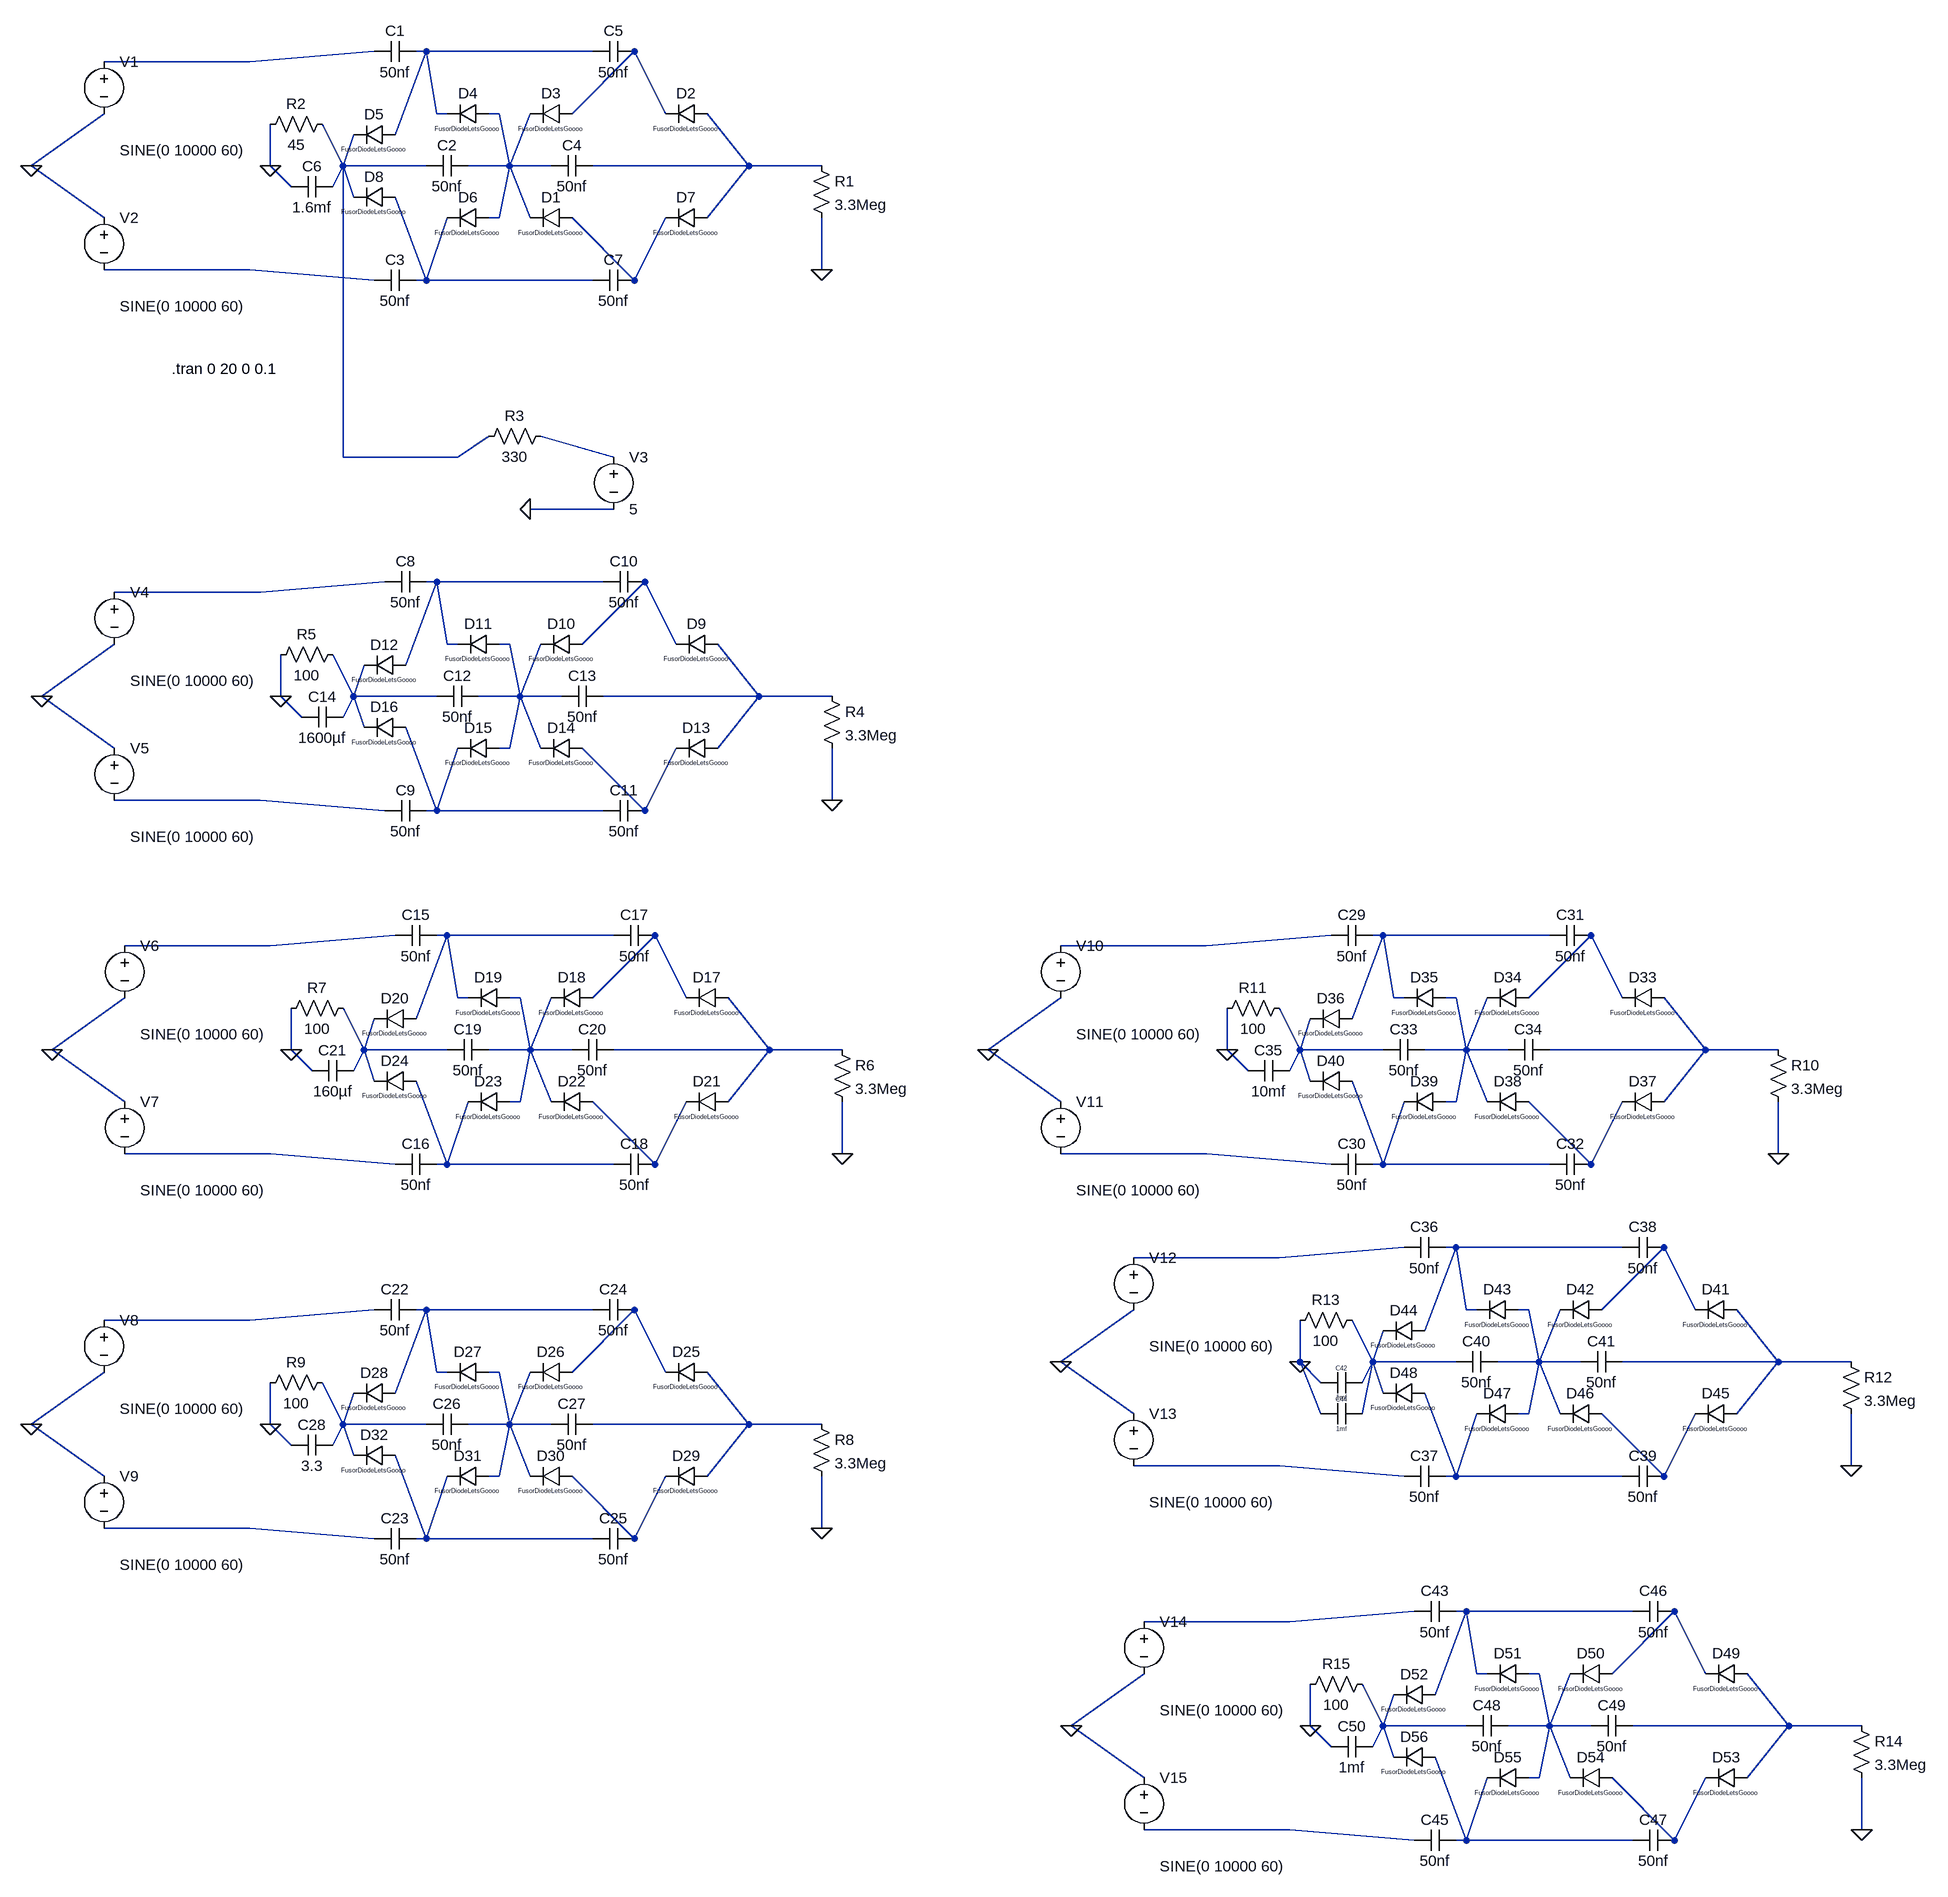
[diagram p0: schematic CW Schematic backup.asc]
CW Schematic backup.asc, the LTspice schematic file:
Version 4
SHEET 1 2396 2776
WIRE 80 -32 64 -32
WIRE 336 -32 80 -32
WIRE -192 -16 0 -32
WIRE -192 -16 -416 -16
WIRE 96 64 80 -32
WIRE 112 64 96 64
WIRE 192 64 176 64
WIRE 304 64 400 -32
WIRE 448 64 400 -32
WIRE 32 96 80 -32
WIRE -528 144 -416 64
WIRE -160 144 -160 80
WIRE -48 144 -80 80
WIRE -48 144 -32 96
WIRE 80 144 -48 144
WIRE 208 144 192 64
WIRE 208 144 240 64
WIRE 208 144 144 144
WIRE 272 144 208 144
WIRE 576 144 512 64
WIRE 576 144 336 144
WIRE 688 144 576 144
WIRE -128 176 -160 144
WIRE -64 176 -48 144
WIRE -32 192 -48 144
WIRE -416 224 -528 144
WIRE 192 224 208 144
WIRE 192 224 176 224
WIRE 240 224 208 144
WIRE 512 224 576 144
WIRE -192 304 -416 304
WIRE 688 304 688 224
WIRE 0 320 -192 304
WIRE 80 320 32 192
WIRE 80 320 112 224
WIRE 80 320 64 320
WIRE 336 320 80 320
WIRE 400 320 304 224
WIRE 400 320 448 224
WIRE -48 592 -48 144
WIRE 128 592 176 560
WIRE 128 592 -48 592
WIRE 368 592 256 560
WIRE 368 672 240 672
WIRE 96 784 80 784
WIRE 352 784 96 784
WIRE -176 800 16 784
WIRE -176 800 -400 800
WIRE 112 880 96 784
WIRE 128 880 112 880
WIRE 208 880 192 880
WIRE 320 880 416 784
WIRE 464 880 416 784
WIRE 48 912 96 784
WIRE -512 960 -400 880
WIRE -144 960 -144 896
WIRE -32 960 -64 896
WIRE -32 960 -16 912
WIRE 96 960 -32 960
WIRE 224 960 208 880
WIRE 224 960 256 880
WIRE 224 960 160 960
WIRE 288 960 224 960
WIRE 592 960 528 880
WIRE 592 960 352 960
WIRE 704 960 592 960
WIRE -112 992 -144 960
WIRE -48 992 -32 960
WIRE -16 1008 -32 960
WIRE -400 1040 -512 960
WIRE 208 1040 224 960
WIRE 208 1040 192 1040
WIRE 256 1040 224 960
WIRE 528 1040 592 960
WIRE -176 1120 -400 1120
WIRE 704 1120 704 1040
WIRE 16 1136 -176 1120
WIRE 96 1136 48 1008
WIRE 96 1136 128 1040
WIRE 96 1136 80 1136
WIRE 352 1136 96 1136
WIRE 416 1136 320 1040
WIRE 416 1136 464 1040
WIRE 112 1328 96 1328
WIRE 368 1328 112 1328
WIRE 1552 1328 1536 1328
WIRE 1808 1328 1552 1328
WIRE -160 1344 32 1328
WIRE -160 1344 -384 1344
WIRE 1280 1344 1472 1328
WIRE 1280 1344 1056 1344
WIRE 128 1424 112 1328
WIRE 144 1424 128 1424
WIRE 224 1424 208 1424
WIRE 336 1424 432 1328
WIRE 480 1424 432 1328
WIRE 1568 1424 1552 1328
WIRE 1584 1424 1568 1424
WIRE 1664 1424 1648 1424
WIRE 1776 1424 1872 1328
WIRE 1920 1424 1872 1328
WIRE 64 1456 112 1328
WIRE 1504 1456 1552 1328
WIRE -496 1504 -384 1424
WIRE -128 1504 -128 1440
WIRE -16 1504 -48 1440
WIRE -16 1504 0 1456
WIRE 112 1504 -16 1504
WIRE 240 1504 224 1424
WIRE 240 1504 272 1424
WIRE 240 1504 176 1504
WIRE 304 1504 240 1504
WIRE 608 1504 544 1424
WIRE 608 1504 368 1504
WIRE 720 1504 608 1504
WIRE 944 1504 1056 1424
WIRE 1312 1504 1312 1440
WIRE 1424 1504 1392 1440
WIRE 1424 1504 1440 1456
WIRE 1552 1504 1424 1504
WIRE 1680 1504 1664 1424
WIRE 1680 1504 1712 1424
WIRE 1680 1504 1616 1504
WIRE 1744 1504 1680 1504
WIRE 2048 1504 1984 1424
WIRE 2048 1504 1808 1504
WIRE 2160 1504 2048 1504
WIRE -96 1536 -128 1504
WIRE -32 1536 -16 1504
WIRE 1344 1536 1312 1504
WIRE 1408 1536 1424 1504
WIRE 0 1552 -16 1504
WIRE 1440 1552 1424 1504
WIRE -384 1584 -496 1504
WIRE 224 1584 240 1504
WIRE 224 1584 208 1584
WIRE 272 1584 240 1504
WIRE 544 1584 608 1504
WIRE 1056 1584 944 1504
WIRE 1664 1584 1680 1504
WIRE 1664 1584 1648 1584
WIRE 1712 1584 1680 1504
WIRE 1984 1584 2048 1504
WIRE -160 1664 -384 1664
WIRE 720 1664 720 1584
WIRE 1280 1664 1056 1664
WIRE 2160 1664 2160 1584
WIRE 32 1680 -160 1664
WIRE 112 1680 64 1552
WIRE 112 1680 144 1584
WIRE 112 1680 96 1680
WIRE 368 1680 112 1680
WIRE 432 1680 336 1584
WIRE 432 1680 480 1584
WIRE 1472 1680 1280 1664
WIRE 1552 1680 1504 1552
WIRE 1552 1680 1584 1584
WIRE 1552 1680 1536 1680
WIRE 1808 1680 1552 1680
WIRE 1872 1680 1776 1584
WIRE 1872 1680 1920 1584
WIRE 1664 1808 1648 1808
WIRE 1920 1808 1664 1808
WIRE 1392 1824 1584 1808
WIRE 1392 1824 1168 1824
WIRE 80 1904 64 1904
WIRE 336 1904 80 1904
WIRE 1680 1904 1664 1808
WIRE 1696 1904 1680 1904
WIRE 1776 1904 1760 1904
WIRE 1888 1904 1984 1808
WIRE 2032 1904 1984 1808
WIRE -192 1920 0 1904
WIRE -192 1920 -416 1920
WIRE 1616 1936 1664 1808
WIRE 1056 1984 1168 1904
WIRE 1424 1984 1424 1920
WIRE 1536 1984 1504 1920
WIRE 1536 1984 1552 1936
WIRE 1664 1984 1536 1984
WIRE 1792 1984 1776 1904
WIRE 1792 1984 1824 1904
WIRE 1792 1984 1728 1984
WIRE 1856 1984 1792 1984
WIRE 2160 1984 2096 1904
WIRE 2160 1984 1920 1984
WIRE 2272 1984 2160 1984
WIRE 96 2000 80 1904
WIRE 112 2000 96 2000
WIRE 192 2000 176 2000
WIRE 304 2000 400 1904
WIRE 448 2000 400 1904
WIRE 1456 2016 1424 1984
WIRE 1520 2016 1536 1984
WIRE 32 2032 80 1904
WIRE 1552 2032 1536 1984
WIRE 1168 2064 1056 1984
WIRE 1456 2064 1424 1984
WIRE 1520 2064 1536 1984
WIRE 1776 2064 1792 1984
WIRE 1776 2064 1760 2064
WIRE 1824 2064 1792 1984
WIRE 2096 2064 2160 1984
WIRE -528 2080 -416 2000
WIRE -160 2080 -160 2016
WIRE -48 2080 -80 2016
WIRE -48 2080 -32 2032
WIRE 80 2080 -48 2080
WIRE 208 2080 192 2000
WIRE 208 2080 240 2000
WIRE 208 2080 144 2080
WIRE 272 2080 208 2080
WIRE 576 2080 512 2000
WIRE 576 2080 336 2080
WIRE 688 2080 576 2080
WIRE -128 2112 -160 2080
WIRE -64 2112 -48 2080
WIRE -32 2128 -48 2080
WIRE 1392 2144 1168 2144
WIRE 2272 2144 2272 2064
WIRE -416 2160 -528 2080
WIRE 192 2160 208 2080
WIRE 192 2160 176 2160
WIRE 240 2160 208 2080
WIRE 512 2160 576 2080
WIRE 1584 2160 1392 2144
WIRE 1664 2160 1616 2032
WIRE 1664 2160 1696 2064
WIRE 1664 2160 1648 2160
WIRE 1920 2160 1664 2160
WIRE 1984 2160 1888 2064
WIRE 1984 2160 2032 2064
WIRE -192 2240 -416 2240
WIRE 688 2240 688 2160
WIRE 0 2256 -192 2240
WIRE 80 2256 32 2128
WIRE 80 2256 112 2160
WIRE 80 2256 64 2256
WIRE 336 2256 80 2256
WIRE 400 2256 304 2160
WIRE 400 2256 448 2160
WIRE 1680 2368 1664 2368
WIRE 1936 2368 1680 2368
WIRE 1408 2384 1600 2368
WIRE 1408 2384 1184 2384
WIRE 1696 2464 1680 2368
WIRE 1712 2464 1696 2464
WIRE 1792 2464 1776 2464
WIRE 1904 2464 2000 2368
WIRE 2048 2464 2000 2368
WIRE 1632 2496 1680 2368
WIRE 1072 2544 1184 2464
WIRE 1440 2544 1440 2480
WIRE 1552 2544 1520 2480
WIRE 1552 2544 1568 2496
WIRE 1680 2544 1552 2544
WIRE 1808 2544 1792 2464
WIRE 1808 2544 1840 2464
WIRE 1808 2544 1744 2544
WIRE 1872 2544 1808 2544
WIRE 2176 2544 2112 2464
WIRE 2176 2544 1936 2544
WIRE 2288 2544 2176 2544
WIRE 1472 2576 1440 2544
WIRE 1536 2576 1552 2544
WIRE 1568 2592 1552 2544
WIRE 1184 2624 1072 2544
WIRE 1792 2624 1808 2544
WIRE 1792 2624 1776 2624
WIRE 1840 2624 1808 2544
WIRE 2112 2624 2176 2544
WIRE 1408 2704 1184 2704
WIRE 2288 2704 2288 2624
WIRE 1600 2720 1408 2704
WIRE 1680 2720 1632 2592
WIRE 1680 2720 1712 2624
WIRE 1680 2720 1664 2720
WIRE 1936 2720 1680 2720
WIRE 2000 2720 1904 2624
WIRE 2000 2720 2048 2624
FLAG -160 144 0
FLAG 688 304 0
FLAG -528 144 0
FLAG 240 672 0
FLAG -144 960 0
FLAG 704 1120 0
FLAG -512 960 0
FLAG -128 1504 0
FLAG 720 1664 0
FLAG -496 1504 0
FLAG -160 2080 0
FLAG 688 2240 0
FLAG -528 2080 0
FLAG 1312 1504 0
FLAG 2160 1664 0
FLAG 944 1504 0
FLAG 1424 1984 0
FLAG 2272 2144 0
FLAG 1056 1984 0
FLAG 1440 2544 0
FLAG 2288 2704 0
FLAG 1072 2544 0
SYMBOL cap 0 -16 R270
WINDOW 0 32 32 VTop 2
WINDOW 3 0 32 VBottom 2
SYMATTR InstName C1
SYMATTR Value 50nf
SYMATTR SpiceLine V=30kV
SYMBOL cap 0 336 R270
WINDOW 0 32 32 VTop 2
WINDOW 3 0 32 VBottom 2
SYMATTR InstName C3
SYMATTR Value 50nf
SYMATTR SpiceLine V=30kV
SYMBOL cap 336 -16 R270
WINDOW 0 32 32 VTop 2
WINDOW 3 0 32 VBottom 2
SYMATTR InstName C5
SYMATTR Value 50nf
SYMATTR SpiceLine V=30kV
SYMBOL voltage -416 -32 R0
WINDOW 123 24 124 Left 2
WINDOW 39 0 0 Left 0
WINDOW 3 24 152 Left 2
SYMATTR Value SINE(0 10000 60)
SYMATTR InstName V1
SYMBOL cap 336 336 R270
WINDOW 0 32 32 VTop 2
WINDOW 3 0 32 VBottom 2
SYMATTR InstName C7
SYMATTR Value 50nf
SYMATTR SpiceLine V=30kV
SYMBOL res 672 128 R0
SYMATTR InstName R1
SYMATTR Value 3.3Meg
SYMBOL cap 80 160 R270
WINDOW 0 32 32 VTop 2
WINDOW 3 0 32 VBottom 2
SYMATTR InstName C2
SYMATTR Value 50nf
SYMATTR SpiceLine V=30kV
SYMBOL cap 272 160 R270
WINDOW 0 32 32 VTop 2
WINDOW 3 0 32 VBottom 2
SYMATTR InstName C4
SYMATTR Value 50nf
SYMATTR SpiceLine V=30kV
SYMBOL diode 512 48 R90
WINDOW 0 0 32 VBottom 2
WINDOW 3 32 32 VTop 0
SYMATTR InstName D2
SYMATTR Value FusorDiodeLetsGoooo
SYMBOL diode 304 48 R90
WINDOW 0 0 32 VBottom 2
WINDOW 3 32 32 VTop 0
SYMATTR InstName D3
SYMATTR Value FusorDiodeLetsGoooo
SYMBOL diode 176 48 R90
WINDOW 0 0 32 VBottom 2
WINDOW 3 32 32 VTop 0
SYMATTR InstName D4
SYMATTR Value FusorDiodeLetsGoooo
SYMBOL diode 32 80 R90
WINDOW 0 0 32 VBottom 2
WINDOW 3 32 32 VTop 0
SYMATTR InstName D5
SYMATTR Value FusorDiodeLetsGoooo
SYMBOL diode 512 208 R90
WINDOW 0 0 32 VBottom 2
WINDOW 3 32 32 VTop 0
SYMATTR InstName D7
SYMATTR Value FusorDiodeLetsGoooo
SYMBOL diode 304 208 R90
WINDOW 0 0 32 VBottom 2
WINDOW 3 32 32 VTop 0
SYMATTR InstName D1
SYMATTR Value FusorDiodeLetsGoooo
SYMBOL diode 176 208 R90
WINDOW 0 0 32 VBottom 2
WINDOW 3 32 32 VTop 0
SYMATTR InstName D6
SYMATTR Value FusorDiodeLetsGoooo
SYMBOL diode 32 176 R90
WINDOW 0 0 32 VBottom 2
WINDOW 3 32 32 VTop 0
SYMATTR InstName D8
SYMATTR Value FusorDiodeLetsGoooo
SYMBOL res -176 96 R270
WINDOW 0 32 56 VTop 2
WINDOW 3 0 56 VBottom 2
SYMATTR InstName R2
SYMATTR Value 45
SYMBOL voltage -416 208 R0
WINDOW 123 24 124 Left 2
WINDOW 39 0 0 Left 0
WINDOW 3 24 152 Left 2
SYMATTR Value SINE(0 10000 60)
SYMATTR InstName V2
SYMBOL cap -128 192 R270
WINDOW 0 32 32 VTop 2
WINDOW 3 0 32 VBottom 2
SYMATTR InstName C6
SYMATTR Value 1.6mf
SYMBOL voltage 368 576 R0
WINDOW 123 0 0 Left 0
WINDOW 39 0 0 Left 0
SYMATTR InstName V3
SYMATTR Value 5
SYMBOL res 272 544 R90
WINDOW 0 0 56 VBottom 2
WINDOW 3 32 56 VTop 2
SYMATTR InstName R3
SYMATTR Value 330
SYMBOL cap 16 800 R270
WINDOW 0 32 32 VTop 2
WINDOW 3 0 32 VBottom 2
SYMATTR InstName C8
SYMATTR Value 50nf
SYMATTR SpiceLine V=30kV
SYMBOL cap 16 1152 R270
WINDOW 0 32 32 VTop 2
WINDOW 3 0 32 VBottom 2
SYMATTR InstName C9
SYMATTR Value 50nf
SYMATTR SpiceLine V=30kV
SYMBOL cap 352 800 R270
WINDOW 0 32 32 VTop 2
WINDOW 3 0 32 VBottom 2
SYMATTR InstName C10
SYMATTR Value 50nf
SYMATTR SpiceLine V=30kV
SYMBOL voltage -400 784 R0
WINDOW 123 24 124 Left 2
WINDOW 39 0 0 Left 0
WINDOW 3 24 152 Left 2
SYMATTR Value SINE(0 10000 60)
SYMATTR InstName V4
SYMBOL cap 352 1152 R270
WINDOW 0 32 32 VTop 2
WINDOW 3 0 32 VBottom 2
SYMATTR InstName C11
SYMATTR Value 50nf
SYMATTR SpiceLine V=30kV
SYMBOL res 688 944 R0
SYMATTR InstName R4
SYMATTR Value 3.3Meg
SYMBOL cap 96 976 R270
WINDOW 0 32 32 VTop 2
WINDOW 3 0 32 VBottom 2
SYMATTR InstName C12
SYMATTR Value 50nf
SYMATTR SpiceLine V=30kV
SYMBOL cap 288 976 R270
WINDOW 0 32 32 VTop 2
WINDOW 3 0 32 VBottom 2
SYMATTR InstName C13
SYMATTR Value 50nf
SYMATTR SpiceLine V=30kV
SYMBOL diode 528 864 R90
WINDOW 0 0 32 VBottom 2
WINDOW 3 32 32 VTop 0
SYMATTR InstName D9
SYMATTR Value FusorDiodeLetsGoooo
SYMBOL diode 320 864 R90
WINDOW 0 0 32 VBottom 2
WINDOW 3 32 32 VTop 0
SYMATTR InstName D10
SYMATTR Value FusorDiodeLetsGoooo
SYMBOL diode 192 864 R90
WINDOW 0 0 32 VBottom 2
WINDOW 3 32 32 VTop 0
SYMATTR InstName D11
SYMATTR Value FusorDiodeLetsGoooo
SYMBOL diode 48 896 R90
WINDOW 0 0 32 VBottom 2
WINDOW 3 32 32 VTop 0
SYMATTR InstName D12
SYMATTR Value FusorDiodeLetsGoooo
SYMBOL diode 528 1024 R90
WINDOW 0 0 32 VBottom 2
WINDOW 3 32 32 VTop 0
SYMATTR InstName D13
SYMATTR Value FusorDiodeLetsGoooo
SYMBOL diode 320 1024 R90
WINDOW 0 0 32 VBottom 2
WINDOW 3 32 32 VTop 0
SYMATTR InstName D14
SYMATTR Value FusorDiodeLetsGoooo
SYMBOL diode 192 1024 R90
WINDOW 0 0 32 VBottom 2
WINDOW 3 32 32 VTop 0
SYMATTR InstName D15
SYMATTR Value FusorDiodeLetsGoooo
SYMBOL diode 48 992 R90
WINDOW 0 0 32 VBottom 2
WINDOW 3 32 32 VTop 0
SYMATTR InstName D16
SYMATTR Value FusorDiodeLetsGoooo
SYMBOL res -160 912 R270
WINDOW 0 32 56 VTop 2
WINDOW 3 0 56 VBottom 2
SYMATTR InstName R5
SYMATTR Value 100
SYMBOL voltage -400 1024 R0
WINDOW 123 24 124 Left 2
WINDOW 39 0 0 Left 0
WINDOW 3 24 152 Left 2
SYMATTR Value SINE(0 10000 60)
SYMATTR InstName V5
SYMBOL cap -112 1008 R270
WINDOW 0 32 32 VTop 2
WINDOW 3 0 32 VBottom 2
SYMATTR InstName C14
SYMATTR Value 1600µf
SYMBOL cap 32 1344 R270
WINDOW 0 32 32 VTop 2
WINDOW 3 0 32 VBottom 2
SYMATTR InstName C15
SYMATTR Value 50nf
SYMATTR SpiceLine V=30kV
SYMBOL cap 32 1696 R270
WINDOW 0 32 32 VTop 2
WINDOW 3 0 32 VBottom 2
SYMATTR InstName C16
SYMATTR Value 50nf
SYMATTR SpiceLine V=30kV
SYMBOL cap 368 1344 R270
WINDOW 0 32 32 VTop 2
WINDOW 3 0 32 VBottom 2
SYMATTR InstName C17
SYMATTR Value 50nf
SYMATTR SpiceLine V=30kV
SYMBOL voltage -384 1328 R0
WINDOW 123 24 124 Left 2
WINDOW 39 0 0 Left 0
WINDOW 3 24 152 Left 2
SYMATTR Value SINE(0 10000 60)
SYMATTR InstName V6
SYMBOL cap 368 1696 R270
WINDOW 0 32 32 VTop 2
WINDOW 3 0 32 VBottom 2
SYMATTR InstName C18
SYMATTR Value 50nf
SYMATTR SpiceLine V=30kV
SYMBOL res 704 1488 R0
SYMATTR InstName R6
SYMATTR Value 3.3Meg
SYMBOL cap 112 1520 R270
WINDOW 0 32 32 VTop 2
WINDOW 3 0 32 VBottom 2
SYMATTR InstName C19
SYMATTR Value 50nf
SYMATTR SpiceLine V=30kV
SYMBOL cap 304 1520 R270
WINDOW 0 32 32 VTop 2
WINDOW 3 0 32 VBottom 2
SYMATTR InstName C20
SYMATTR Value 50nf
SYMATTR SpiceLine V=30kV
SYMBOL diode 544 1408 R90
WINDOW 0 0 32 VBottom 2
WINDOW 3 32 32 VTop 0
SYMATTR InstName D17
SYMATTR Value FusorDiodeLetsGoooo
SYMBOL diode 336 1408 R90
WINDOW 0 0 32 VBottom 2
WINDOW 3 32 32 VTop 0
SYMATTR InstName D18
SYMATTR Value FusorDiodeLetsGoooo
SYMBOL diode 208 1408 R90
WINDOW 0 0 32 VBottom 2
WINDOW 3 32 32 VTop 0
SYMATTR InstName D19
SYMATTR Value FusorDiodeLetsGoooo
SYMBOL diode 64 1440 R90
WINDOW 0 0 32 VBottom 2
WINDOW 3 32 32 VTop 0
SYMATTR InstName D20
SYMATTR Value FusorDiodeLetsGoooo
SYMBOL diode 544 1568 R90
WINDOW 0 0 32 VBottom 2
WINDOW 3 32 32 VTop 0
SYMATTR InstName D21
SYMATTR Value FusorDiodeLetsGoooo
SYMBOL diode 336 1568 R90
WINDOW 0 0 32 VBottom 2
WINDOW 3 32 32 VTop 0
SYMATTR InstName D22
SYMATTR Value FusorDiodeLetsGoooo
SYMBOL diode 208 1568 R90
WINDOW 0 0 32 VBottom 2
WINDOW 3 32 32 VTop 0
SYMATTR InstName D23
SYMATTR Value FusorDiodeLetsGoooo
SYMBOL diode 64 1536 R90
WINDOW 0 0 32 VBottom 2
WINDOW 3 32 32 VTop 0
SYMATTR InstName D24
SYMATTR Value FusorDiodeLetsGoooo
SYMBOL res -144 1456 R270
WINDOW 0 32 56 VTop 2
WINDOW 3 0 56 VBottom 2
SYMATTR InstName R7
SYMATTR Value 100
SYMBOL voltage -384 1568 R0
WINDOW 123 24 124 Left 2
WINDOW 39 0 0 Left 0
WINDOW 3 24 152 Left 2
SYMATTR Value SINE(0 10000 60)
SYMATTR InstName V7
SYMBOL cap -96 1552 R270
WINDOW 0 32 32 VTop 2
WINDOW 3 0 32 VBottom 2
SYMATTR InstName C21
SYMATTR Value 160µf
SYMBOL cap 0 1920 R270
WINDOW 0 32 32 VTop 2
WINDOW 3 0 32 VBottom 2
SYMATTR InstName C22
SYMATTR Value 50nf
SYMATTR SpiceLine V=30kV
SYMBOL cap 0 2272 R270
WINDOW 0 32 32 VTop 2
WINDOW 3 0 32 VBottom 2
SYMATTR InstName C23
SYMATTR Value 50nf
SYMATTR SpiceLine V=30kV
SYMBOL cap 336 1920 R270
WINDOW 0 32 32 VTop 2
WINDOW 3 0 32 VBottom 2
SYMATTR InstName C24
SYMATTR Value 50nf
SYMATTR SpiceLine V=30kV
SYMBOL voltage -416 1904 R0
WINDOW 123 24 124 Left 2
WINDOW 39 0 0 Left 0
WINDOW 3 24 152 Left 2
SYMATTR Value SINE(0 10000 60)
SYMATTR InstName V8
SYMBOL cap 336 2272 R270
WINDOW 0 32 32 VTop 2
WINDOW 3 0 32 VBottom 2
SYMATTR InstName C25
SYMATTR Value 50nf
SYMATTR SpiceLine V=30kV
SYMBOL res 672 2064 R0
SYMATTR InstName R8
SYMATTR Value 3.3Meg
SYMBOL cap 80 2096 R270
WINDOW 0 32 32 VTop 2
WINDOW 3 0 32 VBottom 2
SYMATTR InstName C26
SYMATTR Value 50nf
SYMATTR SpiceLine V=30kV
SYMBOL cap 272 2096 R270
WINDOW 0 32 32 VTop 2
WINDOW 3 0 32 VBottom 2
SYMATTR InstName C27
SYMATTR Value 50nf
SYMATTR SpiceLine V=30kV
SYMBOL diode 512 1984 R90
WINDOW 0 0 32 VBottom 2
WINDOW 3 32 32 VTop 0
SYMATTR InstName D25
SYMATTR Value FusorDiodeLetsGoooo
SYMBOL diode 304 1984 R90
WINDOW 0 0 32 VBottom 2
WINDOW 3 32 32 VTop 0
SYMATTR InstName D26
SYMATTR Value FusorDiodeLetsGoooo
SYMBOL diode 176 1984 R90
WINDOW 0 0 32 VBottom 2
WINDOW 3 32 32 VTop 0
SYMATTR InstName D27
SYMATTR Value FusorDiodeLetsGoooo
SYMBOL diode 32 2016 R90
WINDOW 0 0 32 VBottom 2
WINDOW 3 32 32 VTop 0
SYMATTR InstName D28
SYMATTR Value FusorDiodeLetsGoooo
SYMBOL diode 512 2144 R90
WINDOW 0 0 32 VBottom 2
WINDOW 3 32 32 VTop 0
SYMATTR InstName D29
SYMATTR Value FusorDiodeLetsGoooo
SYMBOL diode 304 2144 R90
WINDOW 0 0 32 VBottom 2
WINDOW 3 32 32 VTop 0
SYMATTR InstName D30
SYMATTR Value FusorDiodeLetsGoooo
SYMBOL diode 176 2144 R90
WINDOW 0 0 32 VBottom 2
WINDOW 3 32 32 VTop 0
SYMATTR InstName D31
SYMATTR Value FusorDiodeLetsGoooo
SYMBOL diode 32 2112 R90
WINDOW 0 0 32 VBottom 2
WINDOW 3 32 32 VTop 0
SYMATTR InstName D32
SYMATTR Value FusorDiodeLetsGoooo
SYMBOL res -176 2032 R270
WINDOW 0 32 56 VTop 2
WINDOW 3 0 56 VBottom 2
SYMATTR InstName R9
SYMATTR Value 100
SYMBOL voltage -416 2144 R0
WINDOW 123 24 124 Left 2
WINDOW 39 0 0 Left 0
WINDOW 3 24 152 Left 2
SYMATTR Value SINE(0 10000 60)
SYMATTR InstName V9
SYMBOL cap -128 2128 R270
WINDOW 0 32 32 VTop 2
WINDOW 3 0 32 VBottom 2
SYMATTR InstName C28
SYMATTR Value 3.3
SYMBOL cap 1472 1344 R270
WINDOW 0 32 32 VTop 2
WINDOW 3 0 32 VBottom 2
SYMATTR InstName C29
SYMATTR Value 50nf
SYMATTR SpiceLine V=30kV
SYMBOL cap 1472 1696 R270
WINDOW 0 32 32 VTop 2
WINDOW 3 0 32 VBottom 2
SYMATTR InstName C30
SYMATTR Value 50nf
SYMATTR SpiceLine V=30kV
SYMBOL cap 1808 1344 R270
WINDOW 0 32 32 VTop 2
WINDOW 3 0 32 VBottom 2
SYMATTR InstName C31
SYMATTR Value 50nf
SYMATTR SpiceLine V=30kV
SYMBOL voltage 1056 1328 R0
WINDOW 123 24 124 Left 2
WINDOW 39 0 0 Left 0
WINDOW 3 24 152 Left 2
SYMATTR Value SINE(0 10000 60)
SYMATTR InstName V10
SYMBOL cap 1808 1696 R270
WINDOW 0 32 32 VTop 2
WINDOW 3 0 32 VBottom 2
SYMATTR InstName C32
SYMATTR Value 50nf
SYMATTR SpiceLine V=30kV
SYMBOL res 2144 1488 R0
SYMATTR InstName R10
SYMATTR Value 3.3Meg
SYMBOL cap 1552 1520 R270
WINDOW 0 32 32 VTop 2
WINDOW 3 0 32 VBottom 2
SYMATTR InstName C33
SYMATTR Value 50nf
SYMATTR SpiceLine V=30kV
SYMBOL cap 1744 1520 R270
WINDOW 0 32 32 VTop 2
WINDOW 3 0 32 VBottom 2
SYMATTR InstName C34
SYMATTR Value 50nf
SYMATTR SpiceLine V=30kV
SYMBOL diode 1984 1408 R90
WINDOW 0 0 32 VBottom 2
WINDOW 3 32 32 VTop 0
SYMATTR InstName D33
SYMATTR Value FusorDiodeLetsGoooo
SYMBOL diode 1776 1408 R90
WINDOW 0 0 32 VBottom 2
WINDOW 3 32 32 VTop 0
SYMATTR InstName D34
SYMATTR Value FusorDiodeLetsGoooo
SYMBOL diode 1648 1408 R90
WINDOW 0 0 32 VBottom 2
WINDOW 3 32 32 VTop 0
SYMATTR InstName D35
SYMATTR Value FusorDiodeLetsGoooo
SYMBOL diode 1504 1440 R90
WINDOW 0 0 32 VBottom 2
WINDOW 3 32 32 VTop 0
SYMATTR InstName D36
SYMATTR Value FusorDiodeLetsGoooo
SYMBOL diode 1984 1568 R90
WINDOW 0 0 32 VBottom 2
WINDOW 3 32 32 VTop 0
SYMATTR InstName D37
SYMATTR Value FusorDiodeLetsGoooo
SYMBOL diode 1776 1568 R90
WINDOW 0 0 32 VBottom 2
WINDOW 3 32 32 VTop 0
SYMATTR InstName D38
SYMATTR Value FusorDiodeLetsGoooo
SYMBOL diode 1648 1568 R90
WINDOW 0 0 32 VBottom 2
WINDOW 3 32 32 VTop 0
SYMATTR InstName D39
SYMATTR Value FusorDiodeLetsGoooo
SYMBOL diode 1504 1536 R90
WINDOW 0 0 32 VBottom 2
WINDOW 3 32 32 VTop 0
SYMATTR InstName D40
SYMATTR Value FusorDiodeLetsGoooo
SYMBOL res 1296 1456 R270
WINDOW 0 32 56 VTop 2
WINDOW 3 0 56 VBottom 2
SYMATTR InstName R11
SYMATTR Value 100
SYMBOL voltage 1056 1568 R0
WINDOW 123 24 124 Left 2
WINDOW 39 0 0 Left 0
WINDOW 3 24 152 Left 2
SYMATTR Value SINE(0 10000 60)
SYMATTR InstName V11
SYMBOL cap 1344 1552 R270
WINDOW 0 32 32 VTop 2
WINDOW 3 0 32 VBottom 2
SYMATTR InstName C35
SYMATTR Value 10mf
SYMBOL cap 1584 1824 R270
WINDOW 0 32 32 VTop 2
WINDOW 3 0 32 VBottom 2
SYMATTR InstName C36
SYMATTR Value 50nf
SYMATTR SpiceLine V=30kV
SYMBOL cap 1584 2176 R270
WINDOW 0 32 32 VTop 2
WINDOW 3 0 32 VBottom 2
SYMATTR InstName C37
SYMATTR Value 50nf
SYMATTR SpiceLine V=30kV
SYMBOL cap 1920 1824 R270
WINDOW 0 32 32 VTop 2
WINDOW 3 0 32 VBottom 2
SYMATTR InstName C38
SYMATTR Value 50nf
SYMATTR SpiceLine V=30kV
SYMBOL voltage 1168 1808 R0
WINDOW 123 24 124 Left 2
WINDOW 39 0 0 Left 0
WINDOW 3 24 152 Left 2
SYMATTR Value SINE(0 10000 60)
SYMATTR InstName V12
SYMBOL cap 1920 2176 R270
WINDOW 0 32 32 VTop 2
WINDOW 3 0 32 VBottom 2
SYMATTR InstName C39
SYMATTR Value 50nf
SYMATTR SpiceLine V=30kV
SYMBOL res 2256 1968 R0
SYMATTR InstName R12
SYMATTR Value 3.3Meg
SYMBOL cap 1664 2000 R270
WINDOW 0 32 32 VTop 2
WINDOW 3 0 32 VBottom 2
SYMATTR InstName C40
SYMATTR Value 50nf
SYMATTR SpiceLine V=30kV
SYMBOL cap 1856 2000 R270
WINDOW 0 32 32 VTop 2
WINDOW 3 0 32 VBottom 2
SYMATTR InstName C41
SYMATTR Value 50nf
SYMATTR SpiceLine V=30kV
SYMBOL diode 2096 1888 R90
WINDOW 0 0 32 VBottom 2
WINDOW 3 32 32 VTop 0
SYMATTR InstName D41
SYMATTR Value FusorDiodeLetsGoooo
SYMBOL diode 1888 1888 R90
WINDOW 0 0 32 VBottom 2
WINDOW 3 32 32 VTop 0
SYMATTR InstName D42
SYMATTR Value FusorDiodeLetsGoooo
SYMBOL diode 1760 1888 R90
WINDOW 0 0 32 VBottom 2
WINDOW 3 32 32 VTop 0
SYMATTR InstName D43
SYMATTR Value FusorDiodeLetsGoooo
SYMBOL diode 1616 1920 R90
WINDOW 0 0 32 VBottom 2
WINDOW 3 32 32 VTop 0
SYMATTR InstName D44
SYMATTR Value FusorDiodeLetsGoooo
SYMBOL diode 2096 2048 R90
WINDOW 0 0 32 VBottom 2
WINDOW 3 32 32 VTop 0
SYMATTR InstName D45
SYMATTR Value FusorDiodeLetsGoooo
SYMBOL diode 1888 2048 R90
WINDOW 0 0 32 VBottom 2
WINDOW 3 32 32 VTop 0
SYMATTR InstName D46
SYMATTR Value FusorDiodeLetsGoooo
SYMBOL diode 1760 2048 R90
WINDOW 0 0 32 VBottom 2
WINDOW 3 32 32 VTop 0
SYMATTR InstName D47
SYMATTR Value FusorDiodeLetsGoooo
SYMBOL diode 1616 2016 R90
WINDOW 0 0 32 VBottom 2
WINDOW 3 32 32 VTop 0
SYMATTR InstName D48
SYMATTR Value FusorDiodeLetsGoooo
SYMBOL res 1408 1936 R270
WINDOW 0 32 56 VTop 2
WINDOW 3 0 56 VBottom 2
SYMATTR InstName R13
SYMATTR Value 100
SYMBOL voltage 1168 2048 R0
WINDOW 123 24 124 Left 2
WINDOW 39 0 0 Left 0
WINDOW 3 24 152 Left 2
SYMATTR Value SINE(0 10000 60)
SYMATTR InstName V13
SYMBOL cap 1456 2032 R270
WINDOW 0 32 32 VTop 0
WINDOW 3 0 32 VBottom 0
SYMATTR InstName C42
SYMATTR Value 1mf
SYMBOL cap 1456 2080 R270
WINDOW 0 32 32 VTop 0
WINDOW 3 0 32 VBottom 0
SYMATTR InstName C44
SYMATTR Value 1mf
SYMBOL cap 1600 2384 R270
WINDOW 0 32 32 VTop 2
WINDOW 3 0 32 VBottom 2
SYMATTR InstName C43
SYMATTR Value 50nf
SYMATTR SpiceLine V=30kV
SYMBOL cap 1600 2736 R270
WINDOW 0 32 32 VTop 2
WINDOW 3 0 32 VBottom 2
SYMATTR InstName C45
SYMATTR Value 50nf
SYMATTR SpiceLine V=30kV
SYMBOL cap 1936 2384 R270
WINDOW 0 32 32 VTop 2
WINDOW 3 0 32 VBottom 2
SYMATTR InstName C46
SYMATTR Value 50nf
SYMATTR SpiceLine V=30kV
SYMBOL voltage 1184 2368 R0
WINDOW 123 24 124 Left 2
WINDOW 39 0 0 Left 0
WINDOW 3 24 152 Left 2
SYMATTR Value SINE(0 10000 60)
SYMATTR InstName V14
SYMBOL cap 1936 2736 R270
WINDOW 0 32 32 VTop 2
WINDOW 3 0 32 VBottom 2
SYMATTR InstName C47
SYMATTR Value 50nf
SYMATTR SpiceLine V=30kV
SYMBOL res 2272 2528 R0
SYMATTR InstName R14
SYMATTR Value 3.3Meg
SYMBOL cap 1680 2560 R270
WINDOW 0 32 32 VTop 2
WINDOW 3 0 32 VBottom 2
SYMATTR InstName C48
SYMATTR Value 50nf
SYMATTR SpiceLine V=30kV
SYMBOL cap 1872 2560 R270
WINDOW 0 32 32 VTop 2
WINDOW 3 0 32 VBottom 2
SYMATTR InstName C49
SYMATTR Value 50nf
SYMATTR SpiceLine V=30kV
SYMBOL diode 2112 2448 R90
WINDOW 0 0 32 VBottom 2
WINDOW 3 32 32 VTop 0
SYMATTR InstName D49
SYMATTR Value FusorDiodeLetsGoooo
SYMBOL diode 1904 2448 R90
WINDOW 0 0 32 VBottom 2
WINDOW 3 32 32 VTop 0
SYMATTR InstName D50
SYMATTR Value FusorDiodeLetsGoooo
SYMBOL diode 1776 2448 R90
WINDOW 0 0 32 VBottom 2
WINDOW 3 32 32 VTop 0
SYMATTR InstName D51
SYMATTR Value FusorDiodeLetsGoooo
SYMBOL diode 1632 2480 R90
WINDOW 0 0 32 VBottom 2
WINDOW 3 32 32 VTop 0
SYMATTR InstName D52
SYMATTR Value FusorDiodeLetsGoooo
SYMBOL diode 2112 2608 R90
WINDOW 0 0 32 VBottom 2
WINDOW 3 32 32 VTop 0
SYMATTR InstName D53
SYMATTR Value FusorDiodeLetsGoooo
SYMBOL diode 1904 2608 R90
WINDOW 0 0 32 VBottom 2
WINDOW 3 32 32 VTop 0
SYMATTR InstName D54
SYMATTR Value FusorDiodeLetsGoooo
SYMBOL diode 1776 2608 R90
WINDOW 0 0 32 VBottom 2
WINDOW 3 32 32 VTop 0
SYMATTR InstName D55
SYMATTR Value FusorDiodeLetsGoooo
SYMBOL diode 1632 2576 R90
WINDOW 0 0 32 VBottom 2
WINDOW 3 32 32 VTop 0
SYMATTR InstName D56
SYMATTR Value FusorDiodeLetsGoooo
SYMBOL res 1424 2496 R270
WINDOW 0 32 56 VTop 2
WINDOW 3 0 56 VBottom 2
SYMATTR InstName R15
SYMATTR Value 100
SYMBOL voltage 1184 2608 R0
WINDOW 123 24 124 Left 2
WINDOW 39 0 0 Left 0
WINDOW 3 24 152 Left 2
SYMATTR Value SINE(0 10000 60)
SYMATTR InstName V15
SYMBOL cap 1472 2592 R270
WINDOW 0 32 32 VTop 2
WINDOW 3 0 32 VBottom 2
SYMATTR InstName C50
SYMATTR Value 1mf
TEXT -312 456 Left 2 !.tran 0 20 0 0.1

The netlist it stands for:
* CW Schematic backup.asc
C1 N002 N001 50nf V=30kV
C3 N007 N008 50nf V=30kV
C5 N001 N004 50nf V=30kV
V1 N002 0 SINE(0 10000 60)
C7 N008 N009 50nf V=30kV
R1 N006 0 3.3Meg
C2 N005 N003 50nf V=30kV
C4 N003 N006 50nf V=30kV
D2 N006 N004 FusorDiodeLetsGoooo
D3 N004 N003 FusorDiodeLetsGoooo
D4 N003 N001 FusorDiodeLetsGoooo
D5 N001 N005 FusorDiodeLetsGoooo
D7 N006 N009 FusorDiodeLetsGoooo
D1 N009 N003 FusorDiodeLetsGoooo
D6 N003 N008 FusorDiodeLetsGoooo
D8 N008 N005 FusorDiodeLetsGoooo
R2 0 N005 45
V2 0 N007 SINE(0 10000 60)
C6 0 N005 1.6mf
V3 N010 0 5
R3 N010 N005 330
C8 N012 N011 50nf V=30kV
C9 N017 N018 50nf V=30kV
C10 N011 N014 50nf V=30kV
V4 N012 0 SINE(0 10000 60)
C11 N018 N019 50nf V=30kV
R4 N016 0 3.3Meg
C12 N015 N013 50nf V=30kV
C13 N013 N016 50nf V=30kV
D9 N016 N014 FusorDiodeLetsGoooo
D10 N014 N013 FusorDiodeLetsGoooo
D11 N013 N011 FusorDiodeLetsGoooo
D12 N011 N015 FusorDiodeLetsGoooo
D13 N016 N019 FusorDiodeLetsGoooo
D14 N019 N013 FusorDiodeLetsGoooo
D15 N013 N018 FusorDiodeLetsGoooo
D16 N018 N015 FusorDiodeLetsGoooo
R5 0 N015 100
V5 0 N017 SINE(0 10000 60)
C14 0 N015 1600µf
C15 N022 N020 50nf V=30kV
C16 N032 N034 50nf V=30kV
C17 N020 N025 50nf V=30kV
V6 N022 0 SINE(0 10000 60)
C18 N034 N035 50nf V=30kV
R6 N029 0 3.3Meg
C19 N028 N024 50nf V=30kV
C20 N024 N029 50nf V=30kV
D17 N029 N025 FusorDiodeLetsGoooo
D18 N025 N024 FusorDiodeLetsGoooo
D19 N024 N020 FusorDiodeLetsGoooo
D20 N020 N028 FusorDiodeLetsGoooo
D21 N029 N035 FusorDiodeLetsGoooo
D22 N035 N024 FusorDiodeLetsGoooo
D23 N024 N034 FusorDiodeLetsGoooo
D24 N034 N028 FusorDiodeLetsGoooo
R7 0 N028 100
V7 0 N032 SINE(0 10000 60)
C21 0 N028 160µf
C22 N043 N040 50nf V=30kV
C23 N053 N054 50nf V=30kV
C24 N040 N047 50nf V=30kV
V8 N043 0 SINE(0 10000 60)
C25 N054 N055 50nf V=30kV
R8 N049 0 3.3Meg
C26 N048 N046 50nf V=30kV
C27 N046 N049 50nf V=30kV
D25 N049 N047 FusorDiodeLetsGoooo
D26 N047 N046 FusorDiodeLetsGoooo
D27 N046 N040 FusorDiodeLetsGoooo
D28 N040 N048 FusorDiodeLetsGoooo
D29 N049 N055 FusorDiodeLetsGoooo
D30 N055 N046 FusorDiodeLetsGoooo
D31 N046 N054 FusorDiodeLetsGoooo
D32 N054 N048 FusorDiodeLetsGoooo
R9 0 N048 100
V9 0 N053 SINE(0 10000 60)
C28 0 N048 3.3
C29 N023 N021 50nf V=30kV
C30 N033 N036 50nf V=30kV
C31 N021 N027 50nf V=30kV
V10 N023 0 SINE(0 10000 60)
C32 N036 N037 50nf V=30kV
R10 N031 0 3.3Meg
C33 N030 N026 50nf V=30kV
C34 N026 N031 50nf V=30kV
D33 N031 N027 FusorDiodeLetsGoooo
D34 N027 N026 FusorDiodeLetsGoooo
D35 N026 N021 FusorDiodeLetsGoooo
D36 N021 N030 FusorDiodeLetsGoooo
D37 N031 N037 FusorDiodeLetsGoooo
D38 N037 N026 FusorDiodeLetsGoooo
D39 N026 N036 FusorDiodeLetsGoooo
D40 N036 N030 FusorDiodeLetsGoooo
R11 0 N030 100
V11 0 N033 SINE(0 10000 60)
C35 0 N030 10mf
C36 N039 N038 50nf V=30kV
C37 N050 N051 50nf V=30kV
C38 N038 N042 50nf V=30kV
V12 N039 0 SINE(0 10000 60)
C39 N051 N052 50nf V=30kV
R12 N045 0 3.3Meg
C40 N044 N041 50nf V=30kV
C41 N041 N045 50nf V=30kV
D41 N045 N042 FusorDiodeLetsGoooo
D42 N042 N041 FusorDiodeLetsGoooo
D43 N041 N038 FusorDiodeLetsGoooo
D44 N038 N044 FusorDiodeLetsGoooo
D45 N045 N052 FusorDiodeLetsGoooo
D46 N052 N041 FusorDiodeLetsGoooo
D47 N041 N051 FusorDiodeLetsGoooo
D48 N051 N044 FusorDiodeLetsGoooo
R13 0 N044 100
V13 0 N050 SINE(0 10000 60)
C42 0 N044 1mf
C44 0 N044 1mf
C43 N057 N056 50nf V=30kV
C45 N062 N063 50nf V=30kV
C46 N056 N059 50nf V=30kV
V14 N057 0 SINE(0 10000 60)
C47 N063 N064 50nf V=30kV
R14 N061 0 3.3Meg
C48 N060 N058 50nf V=30kV
C49 N058 N061 50nf V=30kV
D49 N061 N059 FusorDiodeLetsGoooo
D50 N059 N058 FusorDiodeLetsGoooo
D51 N058 N056 FusorDiodeLetsGoooo
D52 N056 N060 FusorDiodeLetsGoooo
D53 N061 N064 FusorDiodeLetsGoooo
D54 N064 N058 FusorDiodeLetsGoooo
D55 N058 N063 FusorDiodeLetsGoooo
D56 N063 N060 FusorDiodeLetsGoooo
R15 0 N060 100
V15 0 N062 SINE(0 10000 60)
C50 0 N060 1mf
.model D D
.lib standard.dio
.tran 0 20 0 0.1
.backanno
.end